# EAGLE design rec_seeed (EAGLE 7.7.0)
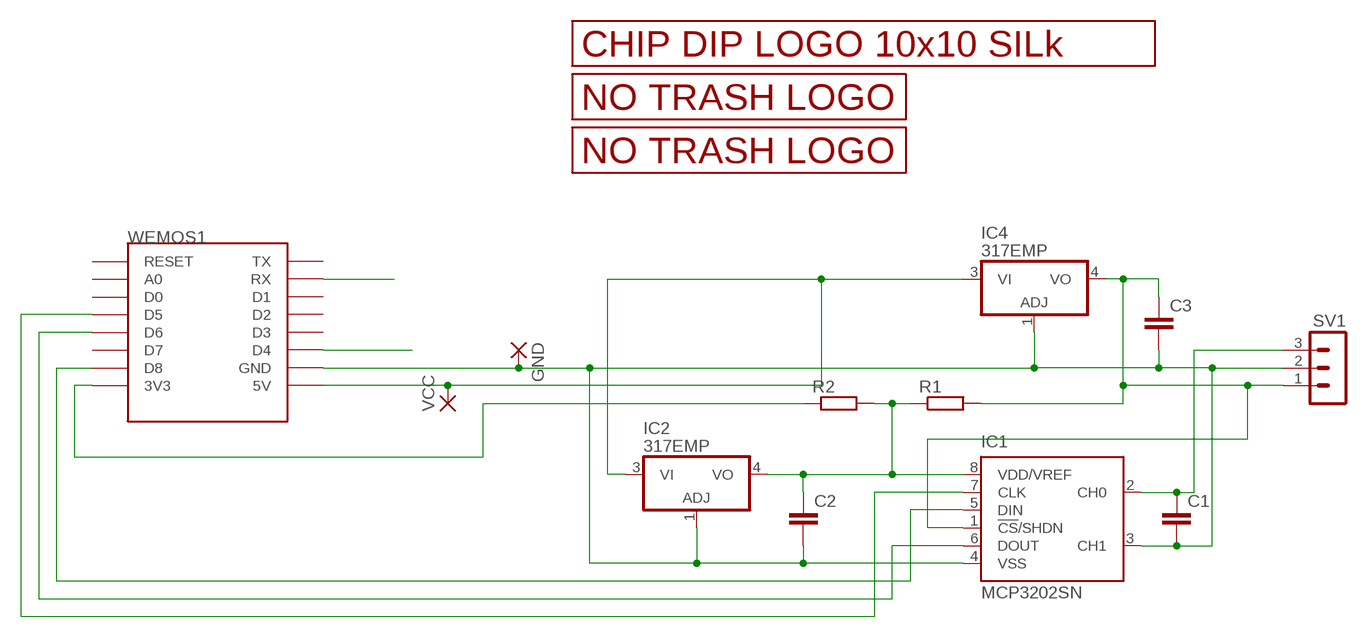
[diagram p0: schematic, sheet 1]

## Parts
C1  C-EUC0805  [C0805]
C2  C-EUC0805  [C0805]
C3  C-EUC0805  [C0805]
GND  SMD1.36X3  [SMD1,36-3]
IC1  MCP3202SN  [SO-08]
IC2  317EMP  [SOT223]
IC4  317EMP  [SOT223]
R1  R-EU_M0805  [M0805]
R2  R-EU_M0805  [M0805]
SV1  MA03-1  [MA03-1]
U$1  LOGO_NO_TRASHNO_TRASH  [LOGO_ROHS_NO_TRASH]
U$2  LOGO_10X10_SILK  [LOGO2_10X10_SILK]
U$3  LOGO_NO_TRASHROHS  [LOGO_ROHS_SYM]
VCC  SMD1.36X3  [SMD1,36-3]
WEMOS1  WEMOS-D1-MININOTXT  [WEMOS_D1_MINI_NOTXT]

## Nets
GND: C1.2 C2.2 C3.2 GND.P$1(P) IC1.3(CH1) IC1.4(VSS) IC2.1(ADJ) IC4.1(ADJ) SV1.2 WEMOS1.GND
N$1: R2.1 WEMOS1.3V3
N$2: IC2.3(VI) IC4.3(VI) VCC.P$1(P) WEMOS1.5V
N$5: WEMOS1.D4
N$6: WEMOS1.RX
N$7: IC1.5(DIN) WEMOS1.D8
N$8: IC1.7(CLK) WEMOS1.D5
N$9: C1.1 IC1.2(CH0) SV1.3
N$11: C3.1 IC1.1(!CS!/SHDN) IC4.4(VO) R1.2 SV1.1
N$13: C2.1 IC1.8(VDD/VREF) IC2.4(VO) R1.1 R2.2
N$16: IC1.6(DOUT) WEMOS1.D6
Unconnected: WEMOS1.A0 WEMOS1.D0 WEMOS1.D1 WEMOS1.D2 WEMOS1.D3 WEMOS1.D7 WEMOS1.RESET WEMOS1.TX

## Library data of the parts
C1-C3 = rcl:C-EU: CAPACITOR, European symbol
GND VCC = JKW_CHIP:SMD1.36X3: SMD PAD
IC1 = microchip:MCP3202: 2.7V Dual Channel 12-Bit A/D Converter with SPI Serial Interface Source: http://ww1.microchip.com/downloads/en/DeviceDoc/21034D.pdf; MF: MICROCHIP; MPN: MCP3202-CI/SN; OC_FARNELL: 1196803; OC_NEWARK: 19C7207
IC2 IC4 = linear:*317: Positive VOLTAGE REGULATOR
R1 R2 = rcl:R-EU_: RESISTOR, European symbol
SV1 = con-lstb:MA03-1: PIN HEADER; OC_FARNELL: unknown; OC_NEWARK: unknown
U$1 U$3 = JKW_CHIP:LOGO_NO_TRASH
U$2 = JKW_CHIP:LOGO_10X10_SILK
WEMOS1 = esp8266modules:WEMOS-D1-MINI: WeMos.cc D1 mini ESP8266 module

## Board
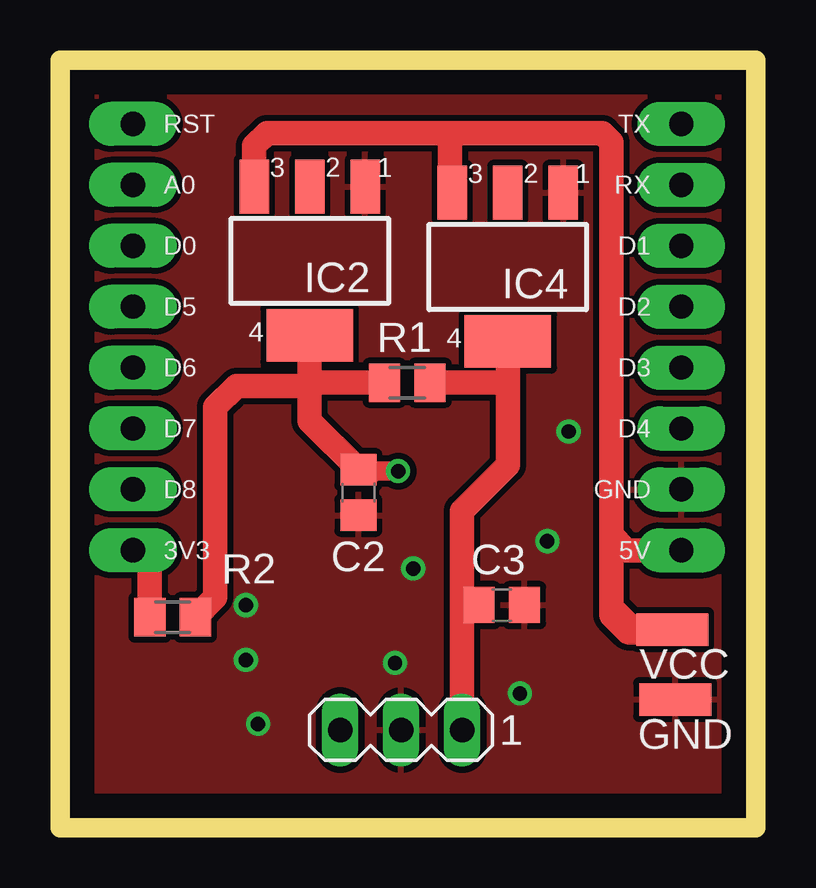
[diagram p1: board, top side]
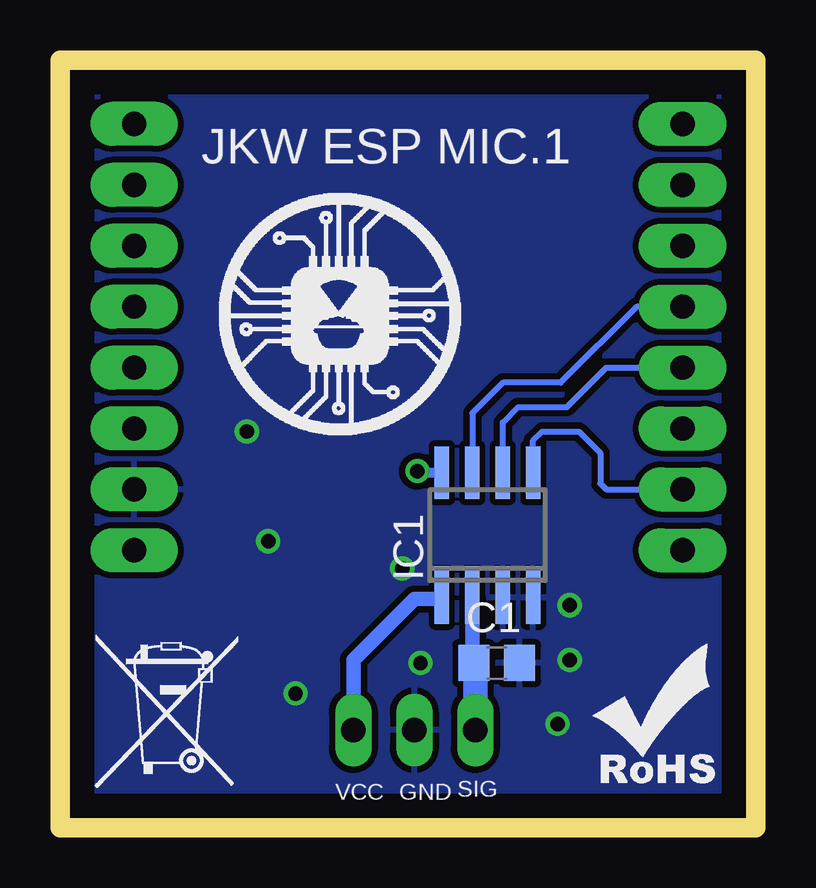
[diagram p2: board, bottom side, seen from below]

Size 29 x 32 mm. Coordinates in mm from the lower left corner, seen from the top.
Outline: 0,0 0,32 29,32 29,0 0,0
Copper layers (1*16): Top 0.035mm / dielectric 1.5mm / Bottom 0.035mm
Design rules "default": minimum track width 10mil, minimum drill 24mil, track to track 8mil, track to pad 8mil, pad to pad 8mil, via to via 8mil, smd to smd 8mil, copper to edge 40mil, drill to drill 8mil, minimum pad ring 10mil, minimum via ring 8mil, stop-mask expansion 4mil, vias tented up to drill 0mil, thermal gap 10mil

### Footprints (pad centres in the part's own frame; a part is rotated, then mirrored left to right if it is on the bottom)
C0805 = smd 1.3 x 1.5: 1 -0.95,0; 2 0.95,0
SMD1,36-3 = smd 1.36 x 3: P$1 0,0
SO-08 = smd 0.6 x 2.2: 1 -1.905,-2.6; 2 -0.635,-2.6; 3 0.635,-2.6; 4 1.905,-2.6; 5 1.905,2.6; 6 0.635,2.6; 7 -0.635,2.6; 8 -1.905,2.6
SOT223 = smd 1.219 x 2.235: 1 -2.311,-3.099; 2 0,-3.099; 3 2.311,-3.099 | smd 3.6 x 2.2: 4 0,3.099
M0805 = smd 1.3 x 1.6: 1 -0.95,0; 2 0.95,0
MA03-1 = drill 1.016 long: 1 -2.54,0; 2 0,0; 3 2.54,0
WEMOS_D1_MINI_NOTXT = drill 1.016 pad 1.829 long: 3V3 -11.43,-11.43; 5V 11.43,-11.43; A0 -11.43,3.81; D0 -11.43,1.27; D1 11.43,1.27; D2 11.43,-1.27; D3 11.43,-3.81; D4 11.43,-6.35; D5 -11.43,-1.27; D6 -11.43,-3.81; D7 -11.43,-6.35; D8 -11.43,-8.89; GND 11.43,-8.89; RESET -11.43,6.35; RX 11.43,3.81; TX 11.43,6.35

### Placement (x,y rotation side)
C1  10.79,6.86 0 bottom
C2  12.45,13.97 270 top
C3  18.41,9.27 0 top
GND  25.65,5.33 90 top
IC1  11.18,12.19 0 bottom
IC2  10.41,23.62 180 top
IC4  18.67,23.37 180 top
R1  14.48,18.54 0 top
R2  4.7,8.76 0 top
SV1  14.22,4.06 180 top
U$1  27.56,1.65 0 bottom
U$2  22.35,16.38 0 bottom
U$3  7.24,1.78 0 bottom
VCC  25.53,8.26 90 top
WEMOS1  14.48,22.99 0 top

### Tracks (layer width: path | path; a pad name or v marks a point on that pad's centre or on a via)
GND  (via drill 0.6)
  other vias: 8.26,4.32 7.75,6.99 7.75,9.27 14.73,10.79 13.97,6.86 19.18,5.59 21.21,16.51 20.32,11.94
  pour Top (isolate 0.254): 0,1 0,31 28,31 28,1
  pour Bottom (isolate 0.254): 0,1 28,1 28,31 0,31
N$1
  Top 1.016: WEMOS1.3V3 3.75,10.86 R2.1
N$2
  Top 1.016: WEMOS1.5V 23.62,11.56 22.99,12.19 | 22.99,12.19 22.99,28.57 22.61,28.96 16.26,28.96 | 16.26,28.96 8.64,28.96 8.1,28.42 IC2.3 | IC4.3 16.26,26.57 16.26,28.96 | 23.11,8.89 22.99,9.02 22.99,12.19
  Top 1.27: VCC.P$1 23.75,8.26 23.11,8.89
N$7
  Bottom 0.254: IC1.5 9.27,16.13 8.89,16.51 7.37,16.51 6.48,15.62 6.48,14.35 6.22,14.1 WEMOS1.D8
N$8
  Bottom 0.254: WEMOS1.D5 4.95,21.72 8.13,18.54 10.54,18.54 11.81,17.27 IC1.7
N$9
  Bottom 0.61: IC1.2 11.81,6.92 C1.1
  Bottom 1.016: SV1.3 11.68,6.8 C1.1
N$11
  Top 1.016: R1.2 18.67,18.54 | 18.67,18.54 18.67,15.11 16.76,13.21 16.76,9.14 | 16.76,9.14 SV1.1 | C3.1 17.34,9.14 16.76,9.14 | IC4.4 18.67,18.54
  Bottom 0.61: SV1.1 16.76,6.99 14.22,9.53 13.15,9.53 IC1.1
N$13  (via drill 0.6)
  Top 0.254: IC1.8 12.95,14.92 C2.1
  Top 0.813: IC1.8 13.15,14.86 v14.1,14.86
  Top 1.016: IC2.4 10.41,18.54 | 10.41,18.54 10.41,18.41 | 10.41,18.41 10.41,16.95 C2.1 | R1.1 10.41,18.54 | R2.2 6.48,9.59 6.48,17.53 7.37,18.41 10.41,18.41
  Bottom 0.406: v14.1,14.86 14.03,14.79 IC1.8
N$16
  Bottom 0.254: IC1.6 10.54,16.89 9.91,17.53 7.87,17.53 6.22,19.18 WEMOS1.D6

### Text on the board
bNames: JKW ESP MIC.1 | SIG | GND | VCC